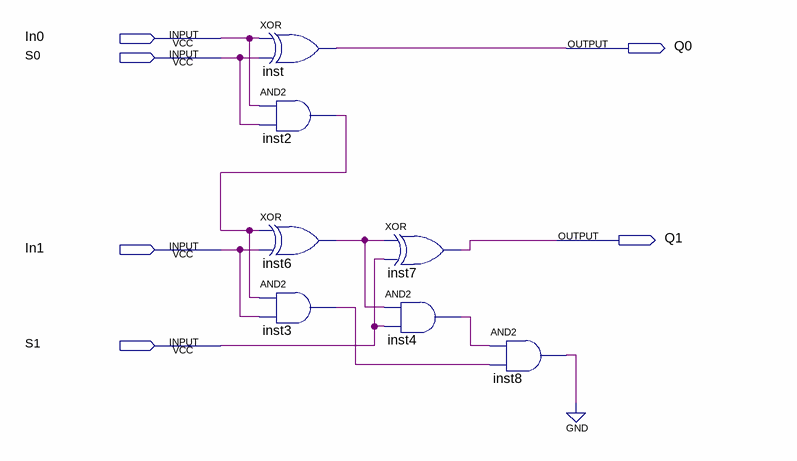
[diagram p0: schematic sheet]
// Quartus schematic 2bit_leftshift.bdf as structural Verilog: 7 symbols, 6 pins
module \2bit_leftshift  (
  input  In0,
  input  S0,
  input  In1,
  input  S1,
  output Q0,
  output Q1
);

  wire inst2_out, inst3_out, inst4_out, inst6_out, inst8_out;

  xor inst (Q0, In0, S0);
  and inst2 (inst2_out, In0, S0);
  xor inst6 (inst6_out, inst2_out, In1);
  and inst3 (inst3_out, inst2_out, In1);
  xor inst7 (Q1, inst6_out, S1);
  and inst4 (inst4_out, inst6_out, S1);
  and inst8 (inst8_out, inst4_out, inst3_out);
  // also tied to GND on the sheet: inst8_out
endmodule
